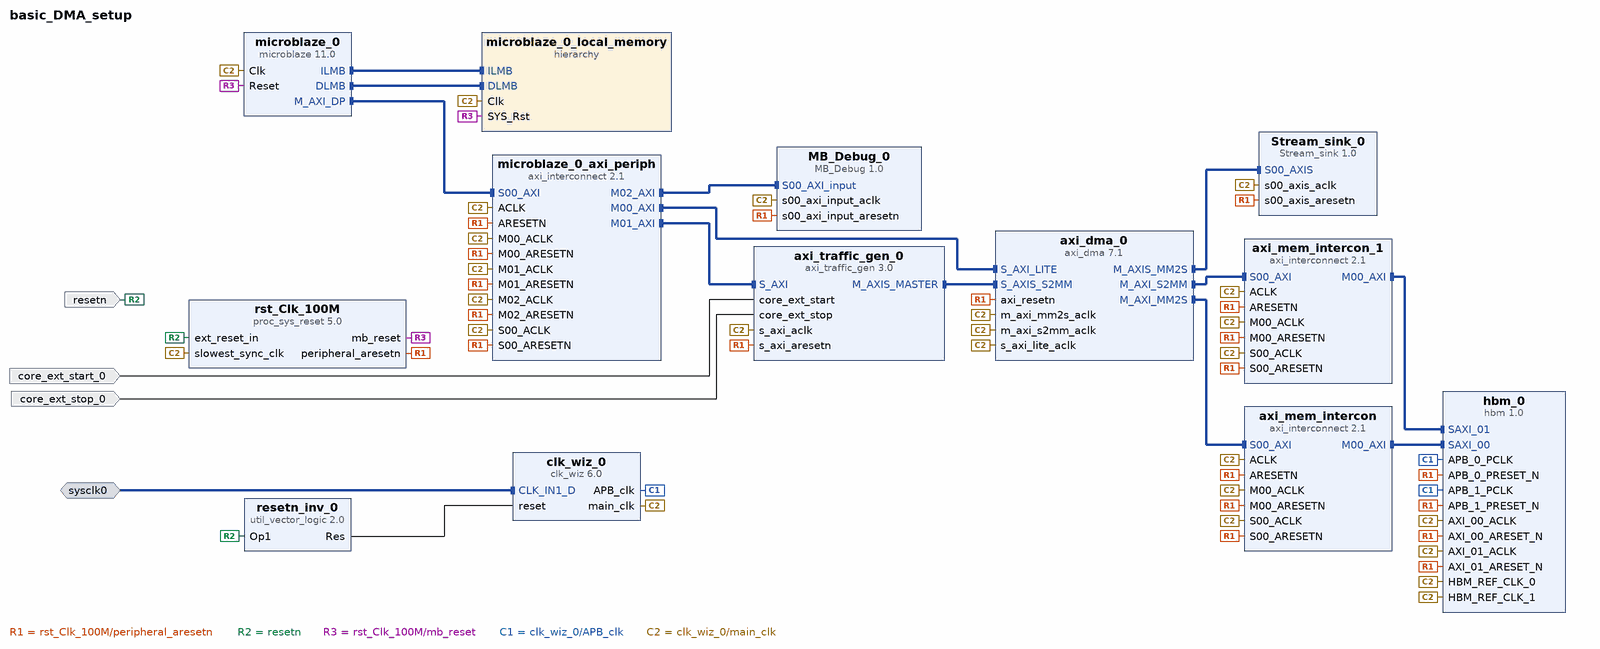
[diagram p0: block diagram of the top level]
# Vivado block design basic_DMA_setup, xcu280-fsvh2892-2L-e, Vivado 2019.2.1
create_bd_design basic_DMA_setup

create_bd_intf_port -mode Slave -vlnv xilinx.com:interface:diff_clock_rtl:1.0 sysclk0
set_property -dict {CONFIG.FREQ_HZ 100000000} [get_bd_intf_ports sysclk0]
create_bd_port -dir I -type rst resetn
set_property -dict {CONFIG.POLARITY ACTIVE_LOW} [get_bd_ports resetn]
create_bd_port -dir I core_ext_start_0
create_bd_port -dir I core_ext_stop_0

create_bd_cell -type ip -vlnv xilinx.com:ip:hbm:1.0 hbm_0
set_property -dict [list \
  CONFIG.HBM_MMCM1_FBOUT_MULT0 18 \
  CONFIG.HBM_MMCM_FBOUT_MULT0 18 \
  CONFIG.USER_APB_EN false \
  CONFIG.USER_AXI_CLK1_FREQ 450 \
  CONFIG.USER_AXI_CLK_FREQ 450 \
  CONFIG.USER_CLK_SEL_LIST0 AXI_00_ACLK \
  CONFIG.USER_CLK_SEL_LIST1 AXI_16_ACLK \
  CONFIG.USER_DFI_CLK0_FREQ 450.000 \
  CONFIG.USER_DFI_CLK1_FREQ 450.000 \
  CONFIG.USER_HBM_CP_0 6 \
  CONFIG.USER_HBM_CP_1 6 \
  CONFIG.USER_HBM_DENSITY 8GB \
  CONFIG.USER_HBM_FBDIV_0 36 \
  CONFIG.USER_HBM_FBDIV_1 36 \
  CONFIG.USER_HBM_HEX_CP_RES_0 0x0000A600 \
  CONFIG.USER_HBM_HEX_CP_RES_1 0x0000A600 \
  CONFIG.USER_HBM_HEX_FBDIV_CLKOUTDIV_0 0x00000902 \
  CONFIG.USER_HBM_HEX_FBDIV_CLKOUTDIV_1 0x00000902 \
  CONFIG.USER_HBM_HEX_LOCK_FB_REF_DLY_0 0x00001f1f \
  CONFIG.USER_HBM_HEX_LOCK_FB_REF_DLY_1 0x00001f1f \
  CONFIG.USER_HBM_LOCK_FB_DLY_0 31 \
  CONFIG.USER_HBM_LOCK_FB_DLY_1 31 \
  CONFIG.USER_HBM_LOCK_REF_DLY_0 31 \
  CONFIG.USER_HBM_LOCK_REF_DLY_1 31 \
  CONFIG.USER_HBM_REF_CLK_0 100 \
  CONFIG.USER_HBM_REF_CLK_1 100 \
  CONFIG.USER_HBM_REF_CLK_PS_0 5000.00 \
  CONFIG.USER_HBM_REF_CLK_PS_1 5000.00 \
  CONFIG.USER_HBM_REF_CLK_XDC_0 10.00 \
  CONFIG.USER_HBM_REF_CLK_XDC_1 10.00 \
  CONFIG.USER_HBM_REF_OUT_CLK_0 1800 \
  CONFIG.USER_HBM_REF_OUT_CLK_1 1800 \
  CONFIG.USER_HBM_RES_0 10 \
  CONFIG.USER_HBM_RES_1 10 \
  CONFIG.USER_HBM_STACK 2 \
  CONFIG.USER_HBM_TCK_0 900 \
  CONFIG.USER_HBM_TCK_0_PERIOD 1.1111111111111112 \
  CONFIG.USER_HBM_TCK_1 900 \
  CONFIG.USER_HBM_TCK_1_PERIOD 1.1111111111111112 \
  CONFIG.USER_LINE_RATE_0 div4 \
  CONFIG.USER_LINE_RATE_1 div4 \
  CONFIG.USER_LINE_RATE_2 div4 \
  CONFIG.USER_LINE_RATE_3 div4 \
  CONFIG.USER_LINE_RATE_4 div4 \
  CONFIG.USER_LINE_RATE_5 div4 \
  CONFIG.USER_LINE_RATE_6 div4 \
  CONFIG.USER_LINE_RATE_7 div4 \
  CONFIG.USER_LINE_RATE_8 div4 \
  CONFIG.USER_LINE_RATE_9 div4 \
  CONFIG.USER_LINE_RATE_10 div4 \
  CONFIG.USER_LINE_RATE_11 div4 \
  CONFIG.USER_LINE_RATE_12 div4 \
  CONFIG.USER_LINE_RATE_13 div4 \
  CONFIG.USER_LINE_RATE_14 div4 \
  CONFIG.USER_LINE_RATE_15 div4 \
  CONFIG.USER_MC0_BG_INTERLEAVE_EN true \
  CONFIG.USER_MC0_CA0_CA5_MAP 0x1c61440c0 \
  CONFIG.USER_MC0_LADDR_BA0_BA4_MAP 0x00282248 \
  CONFIG.USER_MC0_LADDR_CA0_CA4_MAP 0xc61440c0 \
  CONFIG.USER_MC0_LOOKAHEAD_ACT true \
  CONFIG.USER_MC0_LOOKAHEAD_PCH true \
  CONFIG.USER_MC0_MAINTAIN_COHERENCY true \
  CONFIG.USER_MC0_MANUAL_ADDR_MAP_SEL false \
  CONFIG.USER_MC0_REF_CMD_PERIOD 0x0DB6 \
  CONFIG.USER_MC0_REORDER_EN false \
  CONFIG.USER_MC0_REORDER_QUEUE_EN false \
  CONFIG.USER_MC10_BG_INTERLEAVE_EN true \
  CONFIG.USER_MC10_CA0_CA5_MAP 0x1c61440c0 \
  CONFIG.USER_MC10_LADDR_BA0_BA4_MAP 0x00282248 \
  CONFIG.USER_MC10_LADDR_CA0_CA4_MAP 0xc61440c0 \
  CONFIG.USER_MC10_LOOKAHEAD_ACT true \
  CONFIG.USER_MC10_LOOKAHEAD_PCH true \
  CONFIG.USER_MC10_MAINTAIN_COHERENCY true \
  CONFIG.USER_MC10_REF_CMD_PERIOD 0x0DB6 \
  CONFIG.USER_MC10_REORDER_EN false \
  CONFIG.USER_MC10_REORDER_QUEUE_EN false \
  CONFIG.USER_MC11_BG_INTERLEAVE_EN true \
  CONFIG.USER_MC11_CA0_CA5_MAP 0x1c61440c0 \
  CONFIG.USER_MC11_LADDR_BA0_BA4_MAP 0x00282248 \
  CONFIG.USER_MC11_LADDR_CA0_CA4_MAP 0xc61440c0 \
  CONFIG.USER_MC11_LOOKAHEAD_ACT true \
  CONFIG.USER_MC11_LOOKAHEAD_PCH true \
  CONFIG.USER_MC11_MAINTAIN_COHERENCY true \
  CONFIG.USER_MC11_REF_CMD_PERIOD 0x0DB6 \
  CONFIG.USER_MC11_REORDER_EN false \
  CONFIG.USER_MC11_REORDER_QUEUE_EN false \
  CONFIG.USER_MC12_BG_INTERLEAVE_EN true \
  CONFIG.USER_MC12_CA0_CA5_MAP 0x1c61440c0 \
  CONFIG.USER_MC12_LADDR_BA0_BA4_MAP 0x00282248 \
  CONFIG.USER_MC12_LADDR_CA0_CA4_MAP 0xc61440c0 \
  CONFIG.USER_MC12_LOOKAHEAD_ACT true \
  CONFIG.USER_MC12_LOOKAHEAD_PCH true \
  CONFIG.USER_MC12_MAINTAIN_COHERENCY true \
  CONFIG.USER_MC12_REF_CMD_PERIOD 0x0DB6 \
  CONFIG.USER_MC12_REORDER_EN false \
  CONFIG.USER_MC12_REORDER_QUEUE_EN false \
  CONFIG.USER_MC13_BG_INTERLEAVE_EN true \
  CONFIG.USER_MC13_CA0_CA5_MAP 0x1c61440c0 \
  CONFIG.USER_MC13_LADDR_BA0_BA4_MAP 0x00282248 \
  CONFIG.USER_MC13_LADDR_CA0_CA4_MAP 0xc61440c0 \
  CONFIG.USER_MC13_LOOKAHEAD_ACT true \
  CONFIG.USER_MC13_LOOKAHEAD_PCH true \
  CONFIG.USER_MC13_MAINTAIN_COHERENCY true \
  CONFIG.USER_MC13_REF_CMD_PERIOD 0x0DB6 \
  CONFIG.USER_MC13_REORDER_EN false \
  CONFIG.USER_MC13_REORDER_QUEUE_EN false \
  CONFIG.USER_MC14_BG_INTERLEAVE_EN true \
  CONFIG.USER_MC14_CA0_CA5_MAP 0x1c61440c0 \
  CONFIG.USER_MC14_LADDR_BA0_BA4_MAP 0x00282248 \
  CONFIG.USER_MC14_LADDR_CA0_CA4_MAP 0xc61440c0 \
  CONFIG.USER_MC14_LOOKAHEAD_ACT true \
  CONFIG.USER_MC14_LOOKAHEAD_PCH true \
  CONFIG.USER_MC14_MAINTAIN_COHERENCY true \
  CONFIG.USER_MC14_REF_CMD_PERIOD 0x0DB6 \
  CONFIG.USER_MC14_REORDER_EN false \
  CONFIG.USER_MC14_REORDER_QUEUE_EN false \
  CONFIG.USER_MC15_BG_INTERLEAVE_EN true \
  CONFIG.USER_MC15_CA0_CA5_MAP 0x1c61440c0 \
  CONFIG.USER_MC15_LADDR_BA0_BA4_MAP 0x00282248 \
  CONFIG.USER_MC15_LADDR_CA0_CA4_MAP 0xc61440c0 \
  CONFIG.USER_MC15_LOOKAHEAD_ACT true \
  CONFIG.USER_MC15_LOOKAHEAD_PCH true \
  CONFIG.USER_MC15_MAINTAIN_COHERENCY true \
  CONFIG.USER_MC15_REF_CMD_PERIOD 0x0DB6 \
  CONFIG.USER_MC15_REORDER_EN false \
  CONFIG.USER_MC15_REORDER_QUEUE_EN false \
  CONFIG.USER_MC1_BG_INTERLEAVE_EN true \
  CONFIG.USER_MC1_CA0_CA5_MAP 0x1c61440c0 \
  CONFIG.USER_MC1_LADDR_BA0_BA4_MAP 0x00282248 \
  CONFIG.USER_MC1_LADDR_CA0_CA4_MAP 0xc61440c0 \
  CONFIG.USER_MC1_LOOKAHEAD_ACT true \
  CONFIG.USER_MC1_LOOKAHEAD_PCH true \
  CONFIG.USER_MC1_MAINTAIN_COHERENCY true \
  CONFIG.USER_MC1_REF_CMD_PERIOD 0x0DB6 \
  CONFIG.USER_MC1_REORDER_EN false \
  CONFIG.USER_MC1_REORDER_QUEUE_EN false \
  CONFIG.USER_MC2_BG_INTERLEAVE_EN true \
  CONFIG.USER_MC2_CA0_CA5_MAP 0x1c61440c0 \
  CONFIG.USER_MC2_LADDR_BA0_BA4_MAP 0x00282248 \
  CONFIG.USER_MC2_LADDR_CA0_CA4_MAP 0xc61440c0 \
  CONFIG.USER_MC2_LOOKAHEAD_ACT true \
  CONFIG.USER_MC2_LOOKAHEAD_PCH true \
  CONFIG.USER_MC2_MAINTAIN_COHERENCY true \
  CONFIG.USER_MC2_REF_CMD_PERIOD 0x0DB6 \
  CONFIG.USER_MC2_REORDER_EN false \
  CONFIG.USER_MC2_REORDER_QUEUE_EN false \
  CONFIG.USER_MC3_BG_INTERLEAVE_EN true \
  CONFIG.USER_MC3_CA0_CA5_MAP 0x1c61440c0 \
  CONFIG.USER_MC3_LADDR_BA0_BA4_MAP 0x00282248 \
  CONFIG.USER_MC3_LADDR_CA0_CA4_MAP 0xc61440c0 \
  CONFIG.USER_MC3_LOOKAHEAD_ACT true \
  CONFIG.USER_MC3_LOOKAHEAD_PCH true \
  CONFIG.USER_MC3_MAINTAIN_COHERENCY true \
  CONFIG.USER_MC3_REF_CMD_PERIOD 0x0DB6 \
  CONFIG.USER_MC3_REORDER_EN false \
  CONFIG.USER_MC3_REORDER_QUEUE_EN false \
  CONFIG.USER_MC4_BG_INTERLEAVE_EN true \
  CONFIG.USER_MC4_CA0_CA5_MAP 0x1c61440c0 \
  CONFIG.USER_MC4_LADDR_BA0_BA4_MAP 0x00282248 \
  CONFIG.USER_MC4_LADDR_CA0_CA4_MAP 0xc61440c0 \
  CONFIG.USER_MC4_LOOKAHEAD_ACT true \
  CONFIG.USER_MC4_LOOKAHEAD_PCH true \
  CONFIG.USER_MC4_MAINTAIN_COHERENCY true \
  CONFIG.USER_MC4_REF_CMD_PERIOD 0x0DB6 \
  CONFIG.USER_MC4_REORDER_EN false \
  CONFIG.USER_MC4_REORDER_QUEUE_EN false \
  CONFIG.USER_MC5_BG_INTERLEAVE_EN true \
  CONFIG.USER_MC5_CA0_CA5_MAP 0x1c61440c0 \
  CONFIG.USER_MC5_LADDR_BA0_BA4_MAP 0x00282248 \
  CONFIG.USER_MC5_LADDR_CA0_CA4_MAP 0xc61440c0 \
  CONFIG.USER_MC5_LOOKAHEAD_ACT true \
  CONFIG.USER_MC5_LOOKAHEAD_PCH true \
  CONFIG.USER_MC5_MAINTAIN_COHERENCY true \
  CONFIG.USER_MC5_REF_CMD_PERIOD 0x0DB6 \
  CONFIG.USER_MC5_REORDER_EN false \
  CONFIG.USER_MC5_REORDER_QUEUE_EN false \
  CONFIG.USER_MC6_BG_INTERLEAVE_EN true \
  CONFIG.USER_MC6_CA0_CA5_MAP 0x1c61440c0 \
  CONFIG.USER_MC6_LADDR_BA0_BA4_MAP 0x00282248 \
  CONFIG.USER_MC6_LADDR_CA0_CA4_MAP 0xc61440c0 \
  CONFIG.USER_MC6_LOOKAHEAD_ACT true \
  CONFIG.USER_MC6_LOOKAHEAD_PCH true \
  CONFIG.USER_MC6_MAINTAIN_COHERENCY true \
  CONFIG.USER_MC6_REF_CMD_PERIOD 0x0DB6 \
  CONFIG.USER_MC6_REORDER_EN false \
  CONFIG.USER_MC6_REORDER_QUEUE_EN false \
  CONFIG.USER_MC7_BG_INTERLEAVE_EN true \
  CONFIG.USER_MC7_CA0_CA5_MAP 0x1c61440c0 \
  CONFIG.USER_MC7_LADDR_BA0_BA4_MAP 0x00282248 \
  CONFIG.USER_MC7_LADDR_CA0_CA4_MAP 0xc61440c0 \
  CONFIG.USER_MC7_LOOKAHEAD_ACT true \
  CONFIG.USER_MC7_LOOKAHEAD_PCH true \
  CONFIG.USER_MC7_MAINTAIN_COHERENCY true \
  CONFIG.USER_MC7_REF_CMD_PERIOD 0x0DB6 \
  CONFIG.USER_MC7_REORDER_EN false \
  CONFIG.USER_MC7_REORDER_QUEUE_EN false \
  CONFIG.USER_MC8_BG_INTERLEAVE_EN true \
  CONFIG.USER_MC8_CA0_CA5_MAP 0x1c61440c0 \
  CONFIG.USER_MC8_LADDR_BA0_BA4_MAP 0x00282248 \
  CONFIG.USER_MC8_LADDR_CA0_CA4_MAP 0xc61440c0 \
  CONFIG.USER_MC8_LOOKAHEAD_ACT true \
  CONFIG.USER_MC8_LOOKAHEAD_PCH true \
  CONFIG.USER_MC8_MAINTAIN_COHERENCY true \
  CONFIG.USER_MC8_REF_CMD_PERIOD 0x0DB6 \
  CONFIG.USER_MC8_REORDER_EN false \
  CONFIG.USER_MC8_REORDER_QUEUE_EN false \
  CONFIG.USER_MC9_BG_INTERLEAVE_EN true \
  CONFIG.USER_MC9_CA0_CA5_MAP 0x1c61440c0 \
  CONFIG.USER_MC9_LADDR_BA0_BA4_MAP 0x00282248 \
  CONFIG.USER_MC9_LADDR_CA0_CA4_MAP 0xc61440c0 \
  CONFIG.USER_MC9_LOOKAHEAD_ACT true \
  CONFIG.USER_MC9_LOOKAHEAD_PCH true \
  CONFIG.USER_MC9_MAINTAIN_COHERENCY true \
  CONFIG.USER_MC9_REF_CMD_PERIOD 0x0DB6 \
  CONFIG.USER_MC9_REORDER_EN false \
  CONFIG.USER_MC9_REORDER_QUEUE_EN false \
  CONFIG.USER_MC_ENABLE_07 TRUE \
  CONFIG.USER_MC_ENABLE_08 TRUE \
  CONFIG.USER_MC_ENABLE_09 TRUE \
  CONFIG.USER_MC_ENABLE_10 TRUE \
  CONFIG.USER_MC_ENABLE_11 TRUE \
  CONFIG.USER_MC_ENABLE_12 TRUE \
  CONFIG.USER_MC_ENABLE_13 TRUE \
  CONFIG.USER_MC_ENABLE_14 TRUE \
  CONFIG.USER_MC_ENABLE_15 TRUE \
  CONFIG.USER_MC_ENABLE_APB_01 TRUE \
  CONFIG.USER_PHY_ENABLE_08 TRUE \
  CONFIG.USER_PHY_ENABLE_09 TRUE \
  CONFIG.USER_PHY_ENABLE_10 TRUE \
  CONFIG.USER_PHY_ENABLE_11 TRUE \
  CONFIG.USER_PHY_ENABLE_12 TRUE \
  CONFIG.USER_PHY_ENABLE_13 TRUE \
  CONFIG.USER_PHY_ENABLE_14 TRUE \
  CONFIG.USER_PHY_ENABLE_15 TRUE \
  CONFIG.USER_SAXI_01 true \
  CONFIG.USER_SAXI_02 false \
  CONFIG.USER_SAXI_03 false \
  CONFIG.USER_SAXI_04 false \
  CONFIG.USER_SAXI_05 false \
  CONFIG.USER_SAXI_06 false \
  CONFIG.USER_SAXI_07 false \
  CONFIG.USER_SAXI_08 false \
  CONFIG.USER_SAXI_09 false \
  CONFIG.USER_SAXI_10 false \
  CONFIG.USER_SAXI_11 false \
  CONFIG.USER_SAXI_12 false \
  CONFIG.USER_SAXI_13 false \
  CONFIG.USER_SAXI_14 false \
  CONFIG.USER_SAXI_15 false \
  CONFIG.USER_SAXI_16 false \
  CONFIG.USER_SAXI_17 false \
  CONFIG.USER_SAXI_18 false \
  CONFIG.USER_SAXI_19 false \
  CONFIG.USER_SAXI_20 false \
  CONFIG.USER_SAXI_21 false \
  CONFIG.USER_SAXI_22 false \
  CONFIG.USER_SAXI_23 false \
  CONFIG.USER_SAXI_24 false \
  CONFIG.USER_SAXI_25 false \
  CONFIG.USER_SAXI_26 false \
  CONFIG.USER_SAXI_27 false \
  CONFIG.USER_SAXI_28 false \
  CONFIG.USER_SAXI_29 false \
  CONFIG.USER_SAXI_30 false \
  CONFIG.USER_SAXI_31 false \
  CONFIG.USER_SWITCH_ENABLE_01 TRUE \
  CONFIG.USER_TEMP_POLL_CNT_0 100000000 \
  CONFIG.USER_TEMP_POLL_CNT_1 100000000 \
  CONFIG.USER_TEMP_POLL_PERIOD_0 1000 \
  CONFIG.USER_TEMP_POLL_PERIOD_1 1000 \
  CONFIG.USER_XSDB_INTF_EN FALSE \
  CONFIG.USER_tFAW_0 0x00F \
  CONFIG.USER_tFAW_1 0x00F \
  CONFIG.USER_tRAS_0 0x1E \
  CONFIG.USER_tRAS_1 0x1E \
  CONFIG.USER_tRCDRD_0 0x0D \
  CONFIG.USER_tRCDRD_1 0x0D \
  CONFIG.USER_tRCDWR_0 0x09 \
  CONFIG.USER_tRCDWR_1 0x09 \
  CONFIG.USER_tRC_0 0x2B \
  CONFIG.USER_tRC_1 0x2B \
  CONFIG.USER_tRFCSB_0 0x90 \
  CONFIG.USER_tRFCSB_1 0x90 \
  CONFIG.USER_tRFC_0 0x0EA \
  CONFIG.USER_tRFC_1 0x0EA \
  CONFIG.USER_tRP_0 0x0D \
  CONFIG.USER_tRP_1 0x0D \
  CONFIG.USER_tRRDL_0 0x04 \
  CONFIG.USER_tRRDL_1 0x04 \
  CONFIG.USER_tRRDS_0 0x04 \
  CONFIG.USER_tRRDS_1 0x04 \
  CONFIG.USER_tRREFD_0 0x8 \
  CONFIG.USER_tRREFD_1 0x8 \
  CONFIG.USER_tWR_0 0x0F \
  CONFIG.USER_tWR_1 0x0F \
  CONFIG.USER_tWTRL_0 0x8 \
  CONFIG.USER_tWTRL_1 0x8 \
  CONFIG.USER_tWTRS_0 0x4 \
  CONFIG.USER_tWTRS_1 0x4 \
  CONFIG.USER_tXP_0 0x07 \
  CONFIG.USER_tXP_1 0x07 \
] [get_bd_cells hbm_0]
create_bd_cell -type ip -vlnv xilinx.com:ip:axi_traffic_gen:3.0 axi_traffic_gen_0
set_property -dict [list \
  CONFIG.ATG_OPTIONS Custom \
  CONFIG.C_ATG_MODE AXI4-Stream \
  CONFIG.C_AXIS_MODE {Master Only} \
  CONFIG.C_AXIS_SPARSE_EN false \
  CONFIG.C_AXIS_TDATA_WIDTH 256 \
  CONFIG.C_AXIS_TDEST_WIDTH 0 \
  CONFIG.C_AXIS_TID_WIDTH 0 \
  CONFIG.C_AXIS_TUSER_WIDTH 0 \
  CONFIG.DATA_READ_SHARE 0 \
  CONFIG.DATA_SIZE_AVG 16 \
  CONFIG.DATA_TRAFFIC_PATTERN Fixed \
  CONFIG.DATA_TRANS_TYPE Read_Write \
  CONFIG.TRAFFIC_PROFILE Video \
] [get_bd_cells axi_traffic_gen_0]
create_bd_cell -type ip -vlnv xilinx.com:ip:proc_sys_reset:5.0 rst_Clk_100M
set_property -dict {CONFIG.RESET_BOARD_INTERFACE resetn CONFIG.USE_BOARD_FLOW true} [get_bd_cells rst_Clk_100M]
create_bd_cell -type ip -vlnv xilinx.com:ip:axi_interconnect:2.1 microblaze_0_axi_periph
set_property -dict {CONFIG.NUM_MI 3} [get_bd_cells microblaze_0_axi_periph]
create_bd_cell -type ip -vlnv xilinx.com:ip:microblaze:11.0 microblaze_0
set_property -dict [list \
  CONFIG.C_ADDR_TAG_BITS 0 \
  CONFIG.C_DCACHE_ADDR_TAG 0 \
  CONFIG.C_DEBUG_ENABLED 0 \
  CONFIG.C_D_AXI 1 \
  CONFIG.C_D_LMB 1 \
  CONFIG.C_FSL_LINKS 0 \
  CONFIG.C_I_LMB 1 \
  CONFIG.C_TRACE 1 \
  CONFIG.C_USE_DCACHE 0 \
  CONFIG.C_USE_ICACHE 0 \
] [get_bd_cells microblaze_0]
create_bd_cell -type hier microblaze_0_local_memory
create_bd_cell -type ip -vlnv xilinx.com:ip:clk_wiz:6.0 clk_wiz_0
set_property -dict [list \
  CONFIG.AUTO_PRIMITIVE MMCM \
  CONFIG.CLKOUT1_DRIVES BUFGCE \
  CONFIG.CLKOUT1_JITTER 137.681 \
  CONFIG.CLKOUT1_PHASE_ERROR 105.461 \
  CONFIG.CLKOUT1_REQUESTED_OUT_FREQ 100.000 \
  CONFIG.CLKOUT2_DRIVES BUFGCE \
  CONFIG.CLKOUT2_JITTER 137.681 \
  CONFIG.CLKOUT2_PHASE_ERROR 105.461 \
  CONFIG.CLKOUT2_USED true \
  CONFIG.CLKOUT3_DRIVES BUFGCE \
  CONFIG.CLKOUT3_JITTER 103.830 \
  CONFIG.CLKOUT3_PHASE_ERROR 105.461 \
  CONFIG.CLKOUT3_REQUESTED_OUT_FREQ 450.000 \
  CONFIG.CLKOUT3_USED true \
  CONFIG.CLKOUT4_DRIVES BUFGCE \
  CONFIG.CLKOUT5_DRIVES BUFGCE \
  CONFIG.CLKOUT6_DRIVES BUFGCE \
  CONFIG.CLKOUT7_DRIVES BUFGCE \
  CONFIG.CLK_IN1_BOARD_INTERFACE sysclk0 \
  CONFIG.CLK_OUT1_PORT main_clk \
  CONFIG.CLK_OUT2_PORT APB_clk \
  CONFIG.CLK_OUT3_PORT AXI_clk \
  CONFIG.FEEDBACK_SOURCE FDBK_AUTO \
  CONFIG.MMCM_BANDWIDTH OPTIMIZED \
  CONFIG.MMCM_CLKFBOUT_MULT_F 9.000 \
  CONFIG.MMCM_CLKOUT0_DIVIDE_F 9.000 \
  CONFIG.MMCM_CLKOUT1_DIVIDE 9 \
  CONFIG.MMCM_CLKOUT2_DIVIDE 2 \
  CONFIG.MMCM_COMPENSATION AUTO \
  CONFIG.NUM_OUT_CLKS 3 \
  CONFIG.PRIMITIVE MMCM \
  CONFIG.PRIM_SOURCE Differential_clock_capable_pin \
  CONFIG.RESET_BOARD_INTERFACE resetn \
  CONFIG.USE_BOARD_FLOW true \
  CONFIG.USE_LOCKED true \
  CONFIG.USE_RESET true \
  CONFIG.USE_SAFE_CLOCK_STARTUP true \
] [get_bd_cells clk_wiz_0]
create_bd_cell -type ip -vlnv xilinx.com:ip:util_vector_logic:2.0 resetn_inv_0
set_property -dict {CONFIG.C_OPERATION not CONFIG.C_SIZE 1} [get_bd_cells resetn_inv_0]
create_bd_cell -type ip -vlnv user.org:user:MB_Debug:1.0 MB_Debug_0
create_bd_cell -type ip -vlnv xilinx.com:ip:axi_dma:7.1 axi_dma_0
set_property -dict [list \
  CONFIG.c_addr_width 33 \
  CONFIG.c_include_mm2s 1 \
  CONFIG.c_include_s2mm 1 \
  CONFIG.c_include_s2mm_dre 0 \
  CONFIG.c_include_sg 0 \
  CONFIG.c_m_axi_mm2s_data_width 256 \
  CONFIG.c_m_axi_s2mm_data_width 256 \
  CONFIG.c_m_axis_mm2s_tdata_width 256 \
  CONFIG.c_mm2s_burst_size 16 \
  CONFIG.c_s_axis_s2mm_tdata_width 256 \
  CONFIG.c_sg_length_width 24 \
] [get_bd_cells axi_dma_0]
create_bd_cell -type ip -vlnv xilinx.com:ip:axi_interconnect:2.1 axi_mem_intercon
set_property -dict {CONFIG.NUM_MI 1} [get_bd_cells axi_mem_intercon]
create_bd_cell -type ip -vlnv xilinx.com:ip:axi_interconnect:2.1 axi_mem_intercon_1
set_property -dict {CONFIG.NUM_MI 1} [get_bd_cells axi_mem_intercon_1]
create_bd_cell -type ip -vlnv user.org:user:Stream_sink:1.0 Stream_sink_0

# ---- hierarchy /microblaze_0_local_memory ----
current_bd_instance /microblaze_0_local_memory
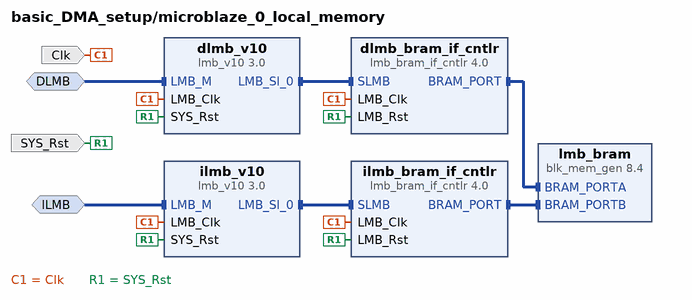
[diagram p1: block diagram inside /microblaze_0_local_memory]
create_bd_intf_pin -mode MirroredMaster -vlnv xilinx.com:interface:lmb_rtl:1.0 DLMB
create_bd_intf_pin -mode MirroredMaster -vlnv xilinx.com:interface:lmb_rtl:1.0 ILMB
create_bd_pin -dir I -type clk Clk
create_bd_pin -dir I -type rst SYS_Rst

create_bd_cell -type ip -vlnv xilinx.com:ip:lmb_v10:3.0 dlmb_v10
create_bd_cell -type ip -vlnv xilinx.com:ip:lmb_v10:3.0 ilmb_v10
create_bd_cell -type ip -vlnv xilinx.com:ip:lmb_bram_if_cntlr:4.0 dlmb_bram_if_cntlr
set_property -dict {CONFIG.C_ECC 0} [get_bd_cells dlmb_bram_if_cntlr]
create_bd_cell -type ip -vlnv xilinx.com:ip:lmb_bram_if_cntlr:4.0 ilmb_bram_if_cntlr
set_property -dict {CONFIG.C_ECC 0} [get_bd_cells ilmb_bram_if_cntlr]
create_bd_cell -type ip -vlnv xilinx.com:ip:blk_mem_gen:8.4 lmb_bram
set_property -dict {CONFIG.Memory_Type True_Dual_Port_RAM CONFIG.use_bram_block BRAM_Controller} [get_bd_cells lmb_bram]

# ---- connections ----

current_bd_instance /microblaze_0_local_memory
connect_bd_intf_net -intf_net microblaze_0_dlmb [get_bd_intf_pins DLMB] [get_bd_intf_pins dlmb_v10/LMB_M]
connect_bd_intf_net -intf_net microblaze_0_ilmb_cntlr [get_bd_intf_pins ilmb_bram_if_cntlr/BRAM_PORT] [get_bd_intf_pins lmb_bram/BRAM_PORTB]
connect_bd_intf_net -intf_net microblaze_0_ilmb [get_bd_intf_pins ILMB] [get_bd_intf_pins ilmb_v10/LMB_M]
connect_bd_intf_net -intf_net microblaze_0_ilmb_bus [get_bd_intf_pins ilmb_v10/LMB_Sl_0] [get_bd_intf_pins ilmb_bram_if_cntlr/SLMB]
connect_bd_intf_net -intf_net microblaze_0_dlmb_bus [get_bd_intf_pins dlmb_v10/LMB_Sl_0] [get_bd_intf_pins dlmb_bram_if_cntlr/SLMB]
connect_bd_intf_net -intf_net microblaze_0_dlmb_cntlr [get_bd_intf_pins dlmb_bram_if_cntlr/BRAM_PORT] [get_bd_intf_pins lmb_bram/BRAM_PORTA]
connect_bd_net -net microblaze_0_Clk [get_bd_pins Clk] \
  [get_bd_pins dlmb_v10/LMB_Clk] [get_bd_pins dlmb_bram_if_cntlr/LMB_Clk] [get_bd_pins ilmb_v10/LMB_Clk] \
  [get_bd_pins ilmb_bram_if_cntlr/LMB_Clk]
connect_bd_net [get_bd_pins SYS_Rst] \
  [get_bd_pins dlmb_v10/SYS_Rst] [get_bd_pins dlmb_bram_if_cntlr/LMB_Rst] [get_bd_pins ilmb_v10/SYS_Rst] \
  [get_bd_pins ilmb_bram_if_cntlr/LMB_Rst]
set_property HDL_ATTRIBUTE.BMM_INFO_ADDRESS_SPACE {byte  0x00000000 32 > basic_DMA_setup microblaze_0_local_memory/lmb_bram} [get_bd_cells dlmb_bram_if_cntlr]
set_property HDL_ATTRIBUTE.KEEP_HIERARCHY yes [get_bd_cells dlmb_bram_if_cntlr]

current_bd_instance /
connect_bd_intf_net [get_bd_intf_pins axi_dma_0/M_AXIS_MM2S] [get_bd_intf_pins Stream_sink_0/S00_AXIS]
connect_bd_intf_net [get_bd_intf_pins microblaze_0/ILMB] [get_bd_intf_pins microblaze_0_local_memory/ILMB]
connect_bd_intf_net [get_bd_intf_pins microblaze_0_axi_periph/M02_AXI] [get_bd_intf_pins MB_Debug_0/S00_AXI_input]
connect_bd_intf_net [get_bd_intf_pins microblaze_0_axi_periph/M00_AXI] [get_bd_intf_pins axi_dma_0/S_AXI_LITE]
connect_bd_intf_net -intf_net sysclk0_1 [get_bd_intf_ports sysclk0] [get_bd_intf_pins clk_wiz_0/CLK_IN1_D]
connect_bd_intf_net [get_bd_intf_pins axi_dma_0/M_AXI_MM2S] [get_bd_intf_pins axi_mem_intercon/S00_AXI]
connect_bd_intf_net [get_bd_intf_pins axi_dma_0/M_AXI_S2MM] [get_bd_intf_pins axi_mem_intercon_1/S00_AXI]
connect_bd_intf_net [get_bd_intf_pins microblaze_0_axi_periph/M01_AXI] [get_bd_intf_pins axi_traffic_gen_0/S_AXI]
connect_bd_intf_net [get_bd_intf_pins axi_mem_intercon/M00_AXI] [get_bd_intf_pins hbm_0/SAXI_00]
connect_bd_intf_net [get_bd_intf_pins axi_traffic_gen_0/M_AXIS_MASTER] [get_bd_intf_pins axi_dma_0/S_AXIS_S2MM]
connect_bd_intf_net [get_bd_intf_pins microblaze_0/DLMB] [get_bd_intf_pins microblaze_0_local_memory/DLMB]
connect_bd_intf_net [get_bd_intf_pins axi_mem_intercon_1/M00_AXI] [get_bd_intf_pins hbm_0/SAXI_01]
connect_bd_intf_net [get_bd_intf_pins microblaze_0/M_AXI_DP] [get_bd_intf_pins microblaze_0_axi_periph/S00_AXI]
connect_bd_net [get_bd_pins rst_Clk_100M/peripheral_aresetn] \
  [get_bd_pins axi_traffic_gen_0/s_axi_aresetn] [get_bd_pins microblaze_0_axi_periph/S00_ARESETN] \
  [get_bd_pins microblaze_0_axi_periph/M00_ARESETN] [get_bd_pins microblaze_0_axi_periph/ARESETN] \
  [get_bd_pins microblaze_0_axi_periph/M01_ARESETN] [get_bd_pins hbm_0/AXI_00_ARESET_N] [get_bd_pins hbm_0/APB_0_PRESET_N] \
  [get_bd_pins MB_Debug_0/s00_axi_input_aresetn] [get_bd_pins axi_dma_0/axi_resetn] [get_bd_pins hbm_0/AXI_01_ARESET_N] \
  [get_bd_pins microblaze_0_axi_periph/M02_ARESETN] [get_bd_pins hbm_0/APB_1_PRESET_N] \
  [get_bd_pins axi_mem_intercon/S00_ARESETN] [get_bd_pins axi_mem_intercon/M00_ARESETN] \
  [get_bd_pins axi_mem_intercon/ARESETN] [get_bd_pins axi_mem_intercon_1/S00_ARESETN] \
  [get_bd_pins axi_mem_intercon_1/M00_ARESETN] [get_bd_pins axi_mem_intercon_1/ARESETN] \
  [get_bd_pins Stream_sink_0/s00_axis_aresetn]
connect_bd_net [get_bd_ports resetn] [get_bd_pins rst_Clk_100M/ext_reset_in] [get_bd_pins resetn_inv_0/Op1]
connect_bd_net -net core_ext_start_0_1 [get_bd_ports core_ext_start_0] [get_bd_pins axi_traffic_gen_0/core_ext_start]
connect_bd_net -net core_ext_stop_0_1 [get_bd_ports core_ext_stop_0] [get_bd_pins axi_traffic_gen_0/core_ext_stop]
connect_bd_net [get_bd_pins rst_Clk_100M/mb_reset] [get_bd_pins microblaze_0/Reset] [get_bd_pins microblaze_0_local_memory/SYS_Rst]
connect_bd_net [get_bd_pins resetn_inv_0/Res] [get_bd_pins clk_wiz_0/reset]
connect_bd_net -net clk_wiz_0_clk_out2 [get_bd_pins clk_wiz_0/APB_clk] [get_bd_pins hbm_0/APB_0_PCLK] [get_bd_pins hbm_0/APB_1_PCLK]
connect_bd_net [get_bd_pins clk_wiz_0/main_clk] \
  [get_bd_pins axi_dma_0/m_axi_mm2s_aclk] [get_bd_pins axi_mem_intercon/S00_ACLK] [get_bd_pins Stream_sink_0/s00_axis_aclk] \
  [get_bd_pins axi_dma_0/m_axi_s2mm_aclk] [get_bd_pins axi_mem_intercon_1/S00_ACLK] \
  [get_bd_pins axi_traffic_gen_0/s_axi_aclk] [get_bd_pins axi_dma_0/s_axi_lite_aclk] \
  [get_bd_pins microblaze_0_axi_periph/M00_ACLK] [get_bd_pins axi_mem_intercon/ACLK] [get_bd_pins axi_mem_intercon/M00_ACLK] \
  [get_bd_pins hbm_0/AXI_00_ACLK] [get_bd_pins axi_mem_intercon_1/ACLK] [get_bd_pins axi_mem_intercon_1/M00_ACLK] \
  [get_bd_pins hbm_0/AXI_01_ACLK] [get_bd_pins hbm_0/HBM_REF_CLK_0] [get_bd_pins hbm_0/HBM_REF_CLK_1] \
  [get_bd_pins MB_Debug_0/s00_axi_input_aclk] [get_bd_pins microblaze_0_axi_periph/M02_ACLK] [get_bd_pins microblaze_0/Clk] \
  [get_bd_pins microblaze_0_local_memory/Clk] [get_bd_pins microblaze_0_axi_periph/S00_ACLK] \
  [get_bd_pins microblaze_0_axi_periph/ACLK] [get_bd_pins microblaze_0_axi_periph/M01_ACLK] \
  [get_bd_pins rst_Clk_100M/slowest_sync_clk]
set_property HDL_ATTRIBUTE.BMM_INFO_PROCESSOR {microblaze-le > basic_DMA_setup microblaze_0_local_memory/dlmb_bram_if_cntlr} [get_bd_cells microblaze_0]
set_property HDL_ATTRIBUTE.KEEP_HIERARCHY yes [get_bd_cells microblaze_0]

# ---- address map ----
assign_bd_address -offset 0x008000000 -range 128M -target_address_space [get_bd_addr_spaces axi_dma_0/Data_MM2S] [get_bd_addr_segs hbm_0/SAXI_00/HBM_MEM00]
assign_bd_address -offset 0x010000000 -range 256M -target_address_space [get_bd_addr_spaces axi_dma_0/Data_MM2S] [get_bd_addr_segs hbm_0/SAXI_00/HBM_MEM01]
assign_bd_address -offset 0x020000000 -range 256M -target_address_space [get_bd_addr_spaces axi_dma_0/Data_MM2S] [get_bd_addr_segs hbm_0/SAXI_00/HBM_MEM02]
assign_bd_address -offset 0x030000000 -range 256M -target_address_space [get_bd_addr_spaces axi_dma_0/Data_MM2S] [get_bd_addr_segs hbm_0/SAXI_00/HBM_MEM03]
assign_bd_address -offset 0x040000000 -range 256M -target_address_space [get_bd_addr_spaces axi_dma_0/Data_MM2S] [get_bd_addr_segs hbm_0/SAXI_00/HBM_MEM04]
assign_bd_address -offset 0x050000000 -range 256M -target_address_space [get_bd_addr_spaces axi_dma_0/Data_MM2S] [get_bd_addr_segs hbm_0/SAXI_00/HBM_MEM05]
assign_bd_address -offset 0x060000000 -range 256M -target_address_space [get_bd_addr_spaces axi_dma_0/Data_MM2S] [get_bd_addr_segs hbm_0/SAXI_00/HBM_MEM06]
assign_bd_address -offset 0x070000000 -range 256M -target_address_space [get_bd_addr_spaces axi_dma_0/Data_MM2S] [get_bd_addr_segs hbm_0/SAXI_00/HBM_MEM07]
assign_bd_address -offset 0x080000000 -range 256M -target_address_space [get_bd_addr_spaces axi_dma_0/Data_MM2S] [get_bd_addr_segs hbm_0/SAXI_00/HBM_MEM08]
assign_bd_address -offset 0x090000000 -range 256M -target_address_space [get_bd_addr_spaces axi_dma_0/Data_MM2S] [get_bd_addr_segs hbm_0/SAXI_00/HBM_MEM09]
assign_bd_address -offset 0x0A0000000 -range 256M -target_address_space [get_bd_addr_spaces axi_dma_0/Data_MM2S] [get_bd_addr_segs hbm_0/SAXI_00/HBM_MEM10]
assign_bd_address -offset 0x0B0000000 -range 256M -target_address_space [get_bd_addr_spaces axi_dma_0/Data_MM2S] [get_bd_addr_segs hbm_0/SAXI_00/HBM_MEM11]
assign_bd_address -offset 0x0C0000000 -range 256M -target_address_space [get_bd_addr_spaces axi_dma_0/Data_MM2S] [get_bd_addr_segs hbm_0/SAXI_00/HBM_MEM12]
assign_bd_address -offset 0x0D0000000 -range 256M -target_address_space [get_bd_addr_spaces axi_dma_0/Data_MM2S] [get_bd_addr_segs hbm_0/SAXI_00/HBM_MEM13]
assign_bd_address -offset 0x0E0000000 -range 256M -target_address_space [get_bd_addr_spaces axi_dma_0/Data_MM2S] [get_bd_addr_segs hbm_0/SAXI_00/HBM_MEM14]
assign_bd_address -offset 0x0F0000000 -range 256M -target_address_space [get_bd_addr_spaces axi_dma_0/Data_MM2S] [get_bd_addr_segs hbm_0/SAXI_00/HBM_MEM15]
assign_bd_address -offset 0x100000000 -range 256M -target_address_space [get_bd_addr_spaces axi_dma_0/Data_MM2S] [get_bd_addr_segs hbm_0/SAXI_00/HBM_MEM16]
assign_bd_address -offset 0x110000000 -range 256M -target_address_space [get_bd_addr_spaces axi_dma_0/Data_MM2S] [get_bd_addr_segs hbm_0/SAXI_00/HBM_MEM17]
assign_bd_address -offset 0x120000000 -range 256M -target_address_space [get_bd_addr_spaces axi_dma_0/Data_MM2S] [get_bd_addr_segs hbm_0/SAXI_00/HBM_MEM18]
assign_bd_address -offset 0x130000000 -range 256M -target_address_space [get_bd_addr_spaces axi_dma_0/Data_MM2S] [get_bd_addr_segs hbm_0/SAXI_00/HBM_MEM19]
assign_bd_address -offset 0x140000000 -range 256M -target_address_space [get_bd_addr_spaces axi_dma_0/Data_MM2S] [get_bd_addr_segs hbm_0/SAXI_00/HBM_MEM20]
assign_bd_address -offset 0x150000000 -range 256M -target_address_space [get_bd_addr_spaces axi_dma_0/Data_MM2S] [get_bd_addr_segs hbm_0/SAXI_00/HBM_MEM21]
assign_bd_address -offset 0x160000000 -range 256M -target_address_space [get_bd_addr_spaces axi_dma_0/Data_MM2S] [get_bd_addr_segs hbm_0/SAXI_00/HBM_MEM22]
assign_bd_address -offset 0x170000000 -range 256M -target_address_space [get_bd_addr_spaces axi_dma_0/Data_MM2S] [get_bd_addr_segs hbm_0/SAXI_00/HBM_MEM23]
assign_bd_address -offset 0x180000000 -range 256M -target_address_space [get_bd_addr_spaces axi_dma_0/Data_MM2S] [get_bd_addr_segs hbm_0/SAXI_00/HBM_MEM24]
assign_bd_address -offset 0x190000000 -range 256M -target_address_space [get_bd_addr_spaces axi_dma_0/Data_MM2S] [get_bd_addr_segs hbm_0/SAXI_00/HBM_MEM25]
assign_bd_address -offset 0x1A0000000 -range 256M -target_address_space [get_bd_addr_spaces axi_dma_0/Data_MM2S] [get_bd_addr_segs hbm_0/SAXI_00/HBM_MEM26]
assign_bd_address -offset 0x1B0000000 -range 256M -target_address_space [get_bd_addr_spaces axi_dma_0/Data_MM2S] [get_bd_addr_segs hbm_0/SAXI_00/HBM_MEM27]
assign_bd_address -offset 0x1C0000000 -range 256M -target_address_space [get_bd_addr_spaces axi_dma_0/Data_MM2S] [get_bd_addr_segs hbm_0/SAXI_00/HBM_MEM28]
assign_bd_address -offset 0x1D0000000 -range 256M -target_address_space [get_bd_addr_spaces axi_dma_0/Data_MM2S] [get_bd_addr_segs hbm_0/SAXI_00/HBM_MEM29]
assign_bd_address -offset 0x1E0000000 -range 256M -target_address_space [get_bd_addr_spaces axi_dma_0/Data_MM2S] [get_bd_addr_segs hbm_0/SAXI_00/HBM_MEM30]
assign_bd_address -offset 0x1F0000000 -range 256M -target_address_space [get_bd_addr_spaces axi_dma_0/Data_MM2S] [get_bd_addr_segs hbm_0/SAXI_00/HBM_MEM31]
assign_bd_address -offset 0x008000000 -range 128M -target_address_space [get_bd_addr_spaces axi_dma_0/Data_S2MM] [get_bd_addr_segs hbm_0/SAXI_01/HBM_MEM00]
assign_bd_address -offset 0x010000000 -range 256M -target_address_space [get_bd_addr_spaces axi_dma_0/Data_S2MM] [get_bd_addr_segs hbm_0/SAXI_01/HBM_MEM01]
assign_bd_address -offset 0x020000000 -range 256M -target_address_space [get_bd_addr_spaces axi_dma_0/Data_S2MM] [get_bd_addr_segs hbm_0/SAXI_01/HBM_MEM02]
assign_bd_address -offset 0x030000000 -range 256M -target_address_space [get_bd_addr_spaces axi_dma_0/Data_S2MM] [get_bd_addr_segs hbm_0/SAXI_01/HBM_MEM03]
assign_bd_address -offset 0x040000000 -range 256M -target_address_space [get_bd_addr_spaces axi_dma_0/Data_S2MM] [get_bd_addr_segs hbm_0/SAXI_01/HBM_MEM04]
assign_bd_address -offset 0x050000000 -range 256M -target_address_space [get_bd_addr_spaces axi_dma_0/Data_S2MM] [get_bd_addr_segs hbm_0/SAXI_01/HBM_MEM05]
assign_bd_address -offset 0x060000000 -range 256M -target_address_space [get_bd_addr_spaces axi_dma_0/Data_S2MM] [get_bd_addr_segs hbm_0/SAXI_01/HBM_MEM06]
assign_bd_address -offset 0x070000000 -range 256M -target_address_space [get_bd_addr_spaces axi_dma_0/Data_S2MM] [get_bd_addr_segs hbm_0/SAXI_01/HBM_MEM07]
assign_bd_address -offset 0x080000000 -range 256M -target_address_space [get_bd_addr_spaces axi_dma_0/Data_S2MM] [get_bd_addr_segs hbm_0/SAXI_01/HBM_MEM08]
assign_bd_address -offset 0x090000000 -range 256M -target_address_space [get_bd_addr_spaces axi_dma_0/Data_S2MM] [get_bd_addr_segs hbm_0/SAXI_01/HBM_MEM09]
assign_bd_address -offset 0x0A0000000 -range 256M -target_address_space [get_bd_addr_spaces axi_dma_0/Data_S2MM] [get_bd_addr_segs hbm_0/SAXI_01/HBM_MEM10]
assign_bd_address -offset 0x0B0000000 -range 256M -target_address_space [get_bd_addr_spaces axi_dma_0/Data_S2MM] [get_bd_addr_segs hbm_0/SAXI_01/HBM_MEM11]
assign_bd_address -offset 0x0C0000000 -range 256M -target_address_space [get_bd_addr_spaces axi_dma_0/Data_S2MM] [get_bd_addr_segs hbm_0/SAXI_01/HBM_MEM12]
assign_bd_address -offset 0x0D0000000 -range 256M -target_address_space [get_bd_addr_spaces axi_dma_0/Data_S2MM] [get_bd_addr_segs hbm_0/SAXI_01/HBM_MEM13]
assign_bd_address -offset 0x0E0000000 -range 256M -target_address_space [get_bd_addr_spaces axi_dma_0/Data_S2MM] [get_bd_addr_segs hbm_0/SAXI_01/HBM_MEM14]
assign_bd_address -offset 0x0F0000000 -range 256M -target_address_space [get_bd_addr_spaces axi_dma_0/Data_S2MM] [get_bd_addr_segs hbm_0/SAXI_01/HBM_MEM15]
assign_bd_address -offset 0x100000000 -range 256M -target_address_space [get_bd_addr_spaces axi_dma_0/Data_S2MM] [get_bd_addr_segs hbm_0/SAXI_01/HBM_MEM16]
assign_bd_address -offset 0x110000000 -range 256M -target_address_space [get_bd_addr_spaces axi_dma_0/Data_S2MM] [get_bd_addr_segs hbm_0/SAXI_01/HBM_MEM17]
assign_bd_address -offset 0x120000000 -range 256M -target_address_space [get_bd_addr_spaces axi_dma_0/Data_S2MM] [get_bd_addr_segs hbm_0/SAXI_01/HBM_MEM18]
assign_bd_address -offset 0x130000000 -range 256M -target_address_space [get_bd_addr_spaces axi_dma_0/Data_S2MM] [get_bd_addr_segs hbm_0/SAXI_01/HBM_MEM19]
assign_bd_address -offset 0x140000000 -range 256M -target_address_space [get_bd_addr_spaces axi_dma_0/Data_S2MM] [get_bd_addr_segs hbm_0/SAXI_01/HBM_MEM20]
assign_bd_address -offset 0x150000000 -range 256M -target_address_space [get_bd_addr_spaces axi_dma_0/Data_S2MM] [get_bd_addr_segs hbm_0/SAXI_01/HBM_MEM21]
assign_bd_address -offset 0x160000000 -range 256M -target_address_space [get_bd_addr_spaces axi_dma_0/Data_S2MM] [get_bd_addr_segs hbm_0/SAXI_01/HBM_MEM22]
assign_bd_address -offset 0x170000000 -range 256M -target_address_space [get_bd_addr_spaces axi_dma_0/Data_S2MM] [get_bd_addr_segs hbm_0/SAXI_01/HBM_MEM23]
assign_bd_address -offset 0x180000000 -range 256M -target_address_space [get_bd_addr_spaces axi_dma_0/Data_S2MM] [get_bd_addr_segs hbm_0/SAXI_01/HBM_MEM24]
assign_bd_address -offset 0x190000000 -range 256M -target_address_space [get_bd_addr_spaces axi_dma_0/Data_S2MM] [get_bd_addr_segs hbm_0/SAXI_01/HBM_MEM25]
assign_bd_address -offset 0x1A0000000 -range 256M -target_address_space [get_bd_addr_spaces axi_dma_0/Data_S2MM] [get_bd_addr_segs hbm_0/SAXI_01/HBM_MEM26]
assign_bd_address -offset 0x1B0000000 -range 256M -target_address_space [get_bd_addr_spaces axi_dma_0/Data_S2MM] [get_bd_addr_segs hbm_0/SAXI_01/HBM_MEM27]
assign_bd_address -offset 0x1C0000000 -range 256M -target_address_space [get_bd_addr_spaces axi_dma_0/Data_S2MM] [get_bd_addr_segs hbm_0/SAXI_01/HBM_MEM28]
assign_bd_address -offset 0x1D0000000 -range 256M -target_address_space [get_bd_addr_spaces axi_dma_0/Data_S2MM] [get_bd_addr_segs hbm_0/SAXI_01/HBM_MEM29]
assign_bd_address -offset 0x1E0000000 -range 256M -target_address_space [get_bd_addr_spaces axi_dma_0/Data_S2MM] [get_bd_addr_segs hbm_0/SAXI_01/HBM_MEM30]
assign_bd_address -offset 0x1F0000000 -range 256M -target_address_space [get_bd_addr_spaces axi_dma_0/Data_S2MM] [get_bd_addr_segs hbm_0/SAXI_01/HBM_MEM31]
assign_bd_address -offset 0x00000000 -range 128K -target_address_space [get_bd_addr_spaces microblaze_0/Data] [get_bd_addr_segs microblaze_0_local_memory/dlmb_bram_if_cntlr/SLMB/Mem]
assign_bd_address -offset 0x41E00000 -range 64K -target_address_space [get_bd_addr_spaces microblaze_0/Data] [get_bd_addr_segs axi_dma_0/S_AXI_LITE/Reg]
assign_bd_address -offset 0x44A00000 -range 64K -target_address_space [get_bd_addr_spaces microblaze_0/Data] [get_bd_addr_segs axi_traffic_gen_0/S_AXI/Reg0]
assign_bd_address -offset 0x44A20000 -range 64K -target_address_space [get_bd_addr_spaces microblaze_0/Data] [get_bd_addr_segs MB_Debug_0/S00_AXI_input/S00_AXI_input_reg]
assign_bd_address -offset 0x00000000 -range 128K -target_address_space [get_bd_addr_spaces microblaze_0/Instruction] [get_bd_addr_segs microblaze_0_local_memory/ilmb_bram_if_cntlr/SLMB/Mem]

validate_bd_design
save_bd_design
